# EasyEDA schematic 2 HF Upconverter (SMD)_ Crystal oscillator.json
TITLE: HF Upconverter (SMD): Crystal oscillator; REV: 8.15.EE; Date: 2018-03-05; Sheet: 2/3; Drawn By: IgrikXD
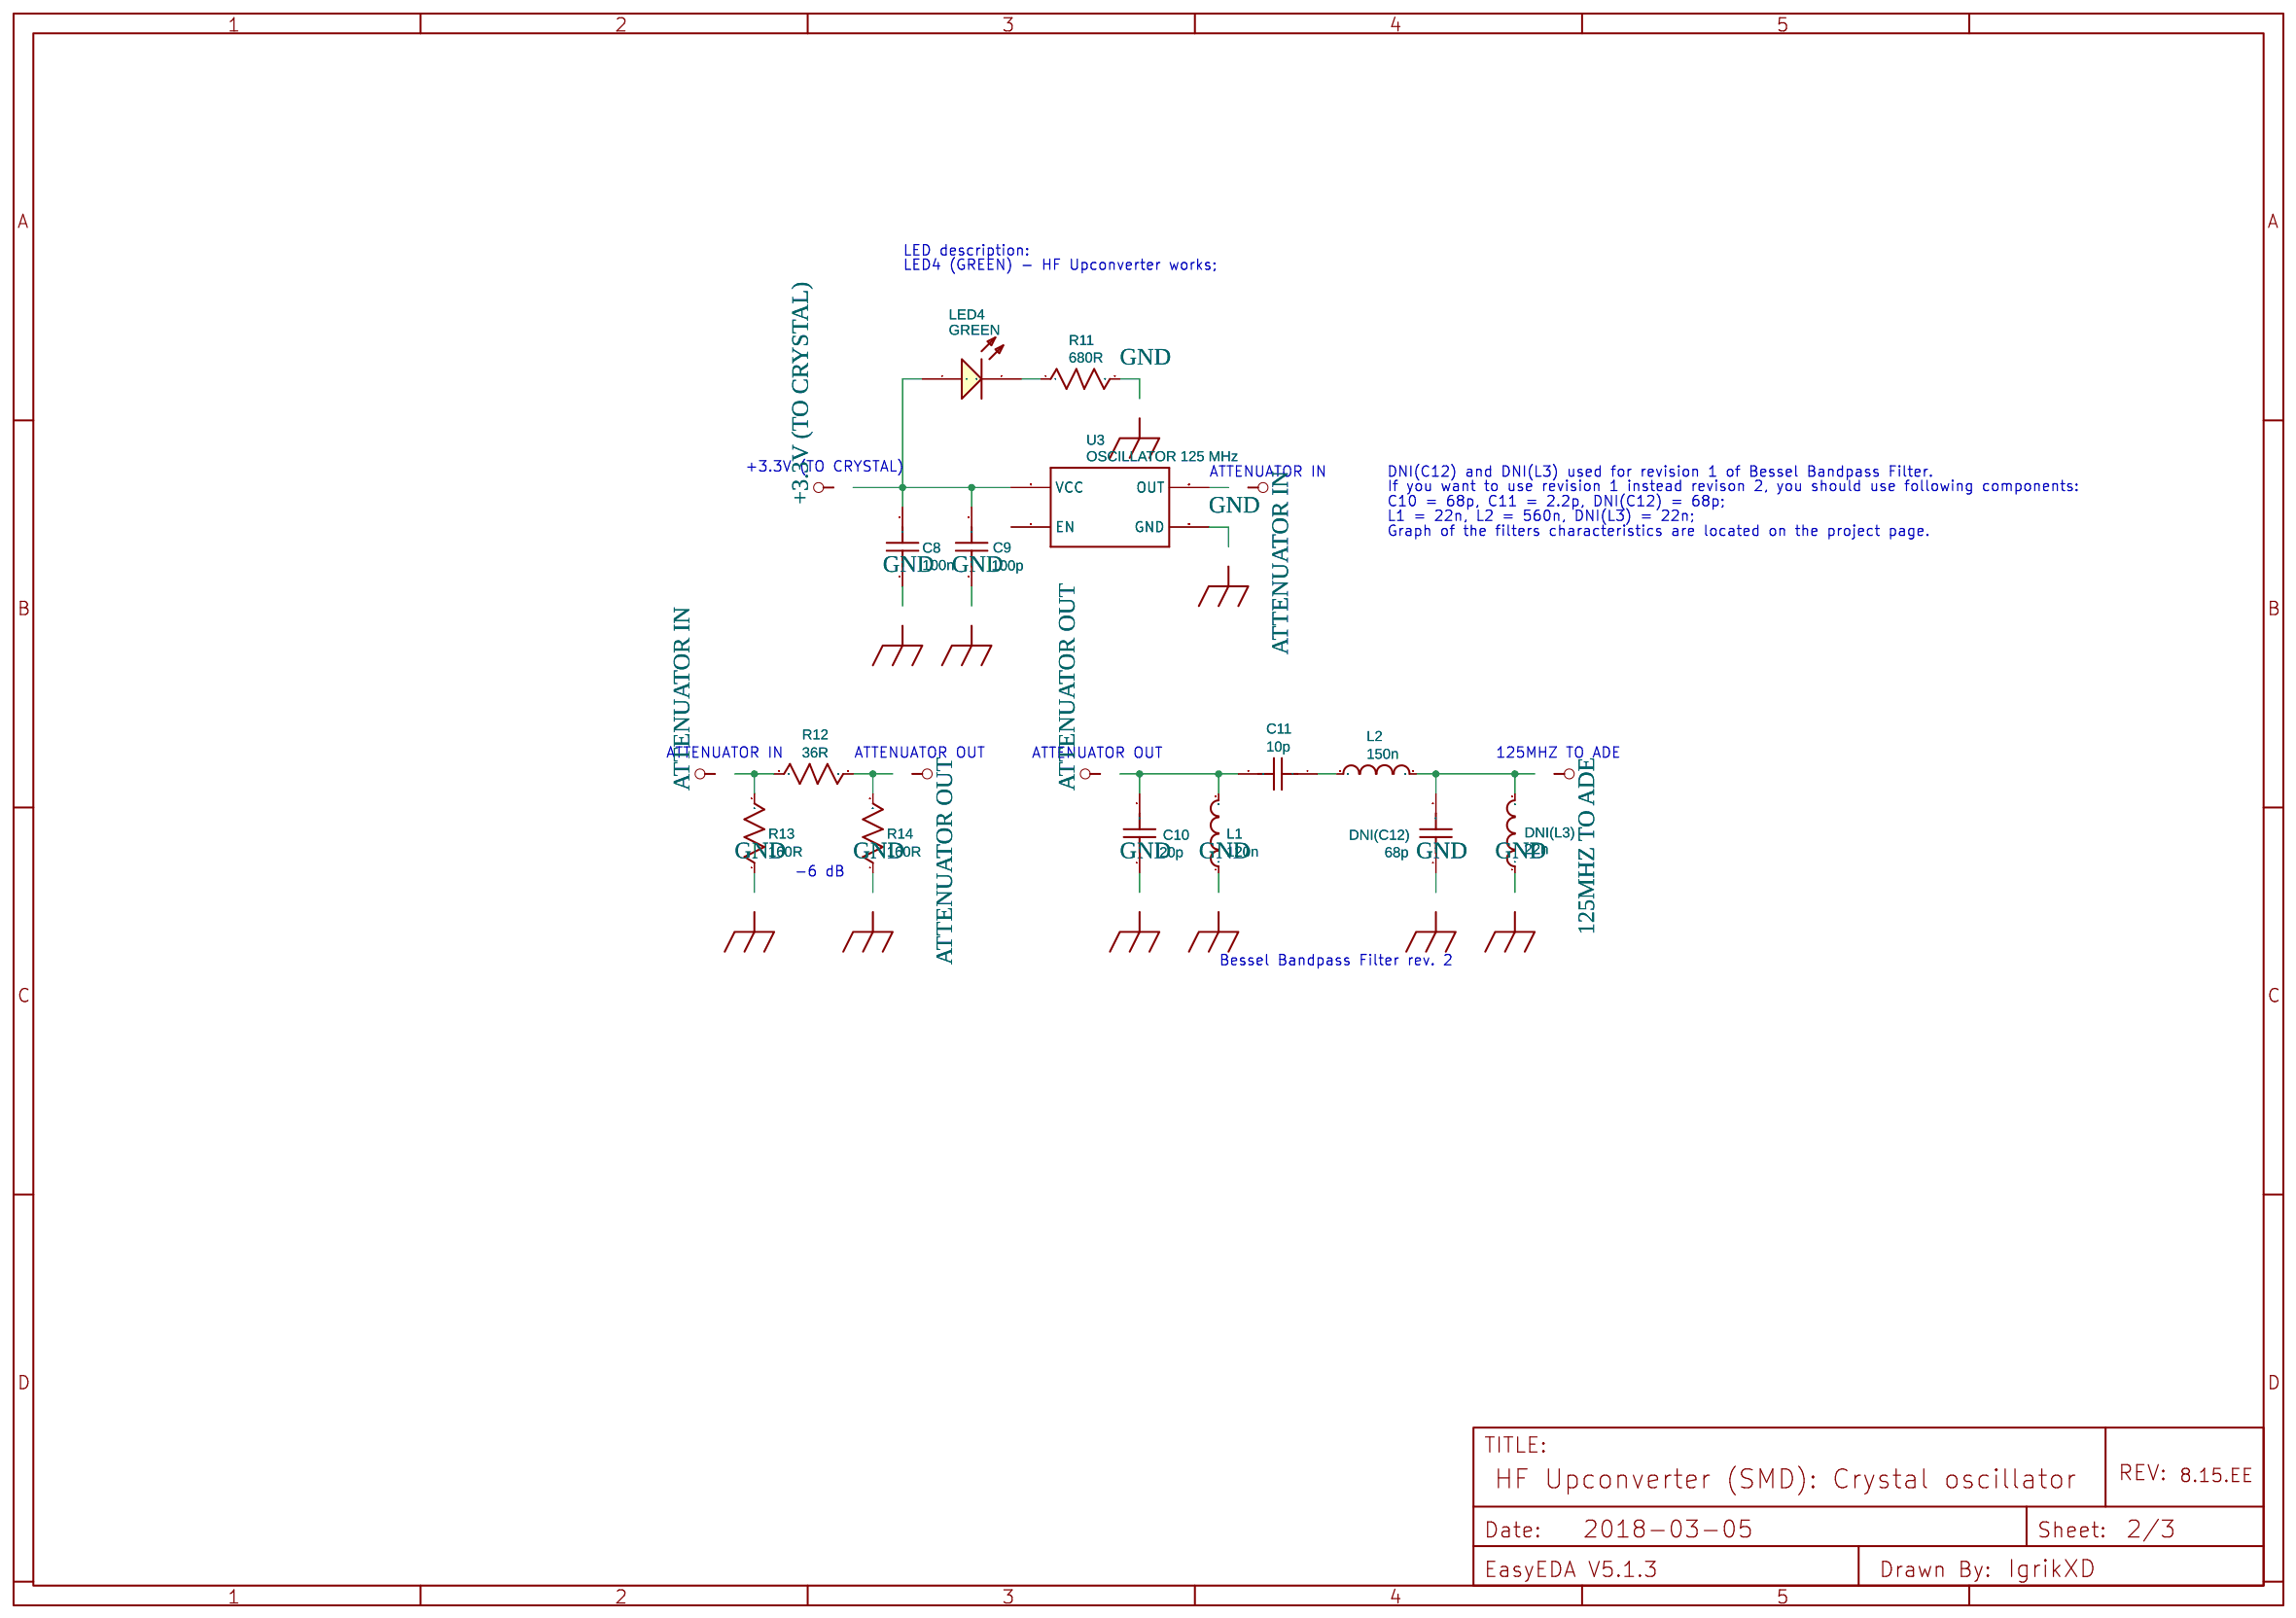
[diagram p0: schematic sheet]

## Parts
C8  100n  [0805]
C9  100p  [0805]
C10  20p  [0805]
C11  10p  [0805]
DNI(C12)  68p  [0805]
DNI(L3)  22n  [0805]
L1  120n  [0805]
L2  150n  [0805]
LED4  GREEN  [LED-0805]
R11  680R  [0805]
R12  36R  [0805]
R13  160R  [0805]
R14  160R  [0805]
U3  OSCILLATOR 125 MHz  [CRYSTAL-SMD-7X5]

## Library data of the parts
C8 = Capacitor: Manufacturer Part: 08055C104JAT2A; Supplier: LCSC; LCSC: C129175; Manufacturer: AVX
C9 = Capacitor: Manufacturer Part: C2012C0G2A101JT000N; Supplier: LCSC; LCSC: C76633; Manufacturer: TDK
C10 = Capacitor: Manufacturer Part: 0805CG200J500NT; Supplier: LCSC; LCSC: C94472; Manufacturer: FH
C11 = Capacitor: Manufacturer Part: 0805N100J500; Supplier: LCSC; LCSC: C123640; Manufacturer: WTC
DNI(C12) = Capacitor: Supplier: LCSC; LCSC: C123650; Manufacturer: WTC; Manufacturer Part: 0805N680J500
DNI(L3) = Inductor: Manufacturer Part: BKW0805UC022JGT; Supplier: LCSC; LCSC: C107467; Manufacturer: FH-BK
L1 = Inductor: Manufacturer Part: BKW0805UCR12JGT; Supplier: LCSC; LCSC: C98546; Manufacturer: FH-BK
L2 = Inductor: Manufacturer Part: BKW0805UCR15JGT; Supplier: LCSC; LCSC: C107465; Manufacturer: FH-BK
LED4 = -: Supplier: LCSC; Manufacturer: EVERLIGHT; Manufacturer Part: 17-21/GHC-YR1S2/3T; LCSC: C73546
R11 = Resistor: Manufacturer Part: RC0805FR-07680RL; Supplier: LCSC; Manufacturer: YAGEO; LCSC: C114549
R12 = Resistor: Manufacturer Part: RTT0536R0FTP; Supplier: LCSC; LCSC: C104270; Manufacturer: RALEC
R13 R14 = Resistor: Manufacturer Part: CR0805F81600G; Supplier: LCSC; LCSC: C101494; Manufacturer: LIZ
U3 = -: catid: 20; Contributor: SparkFun; Manufacturer Part: FNEPON125; Supplier: Digi-Key; Digi-Key: FNEPON125TR-ND; Manufacturer: Diodes Incorporated

## Nets
+3.3V (TO CRYSTAL): C8.2 C9.2 LED4.1(A) U3.P$4(VCC)
GND: C8.1 C9.1 C10.1 DNI(C12).1 DNI(L3).1 L1.1 R11.2 R13.1 R14.1 U3.P$2(GND)
125MHZ TO ADE: DNI(C12).2 DNI(L3).2 L2.2
ATTENUATOR IN: R12.1 R13.2 U3.P$3(OUT)
ATTENUATOR OUT: C10.2 C11.2 L1.2 R12.2 R14.2
Net-(C11-1): C11.1 L2.1
Net-(LED4-2): LED4.2(C) R11.1

Not connected (* = marked no-connect by the designer): U3 P$1(EN)

## Notes on the sheet
- LED description:
- LED4 (GREEN) - HF Upconverter works;
- +3.3V (TO CRYSTAL)
- ATTENUATOR IN
- DNI(C12) and DNI(L3) used for revision 1 of Bessel Bandpass Filter.
- If you want to use revision 1 instead revison 2, you should use following components:
- C10 = 68p, C11 = 2.2p, DNI(C12) = 68p;
- L1 = 22n, L2 = 560n, DNI(L3) = 22n;
- Graph of the filters characteristics are located on the project page.
- ATTENUATOR IN
- ATTENUATOR OUT
- ATTENUATOR OUT
- 125MHZ TO ADE
- -6 dB
- Bessel Bandpass Filter rev. 2
